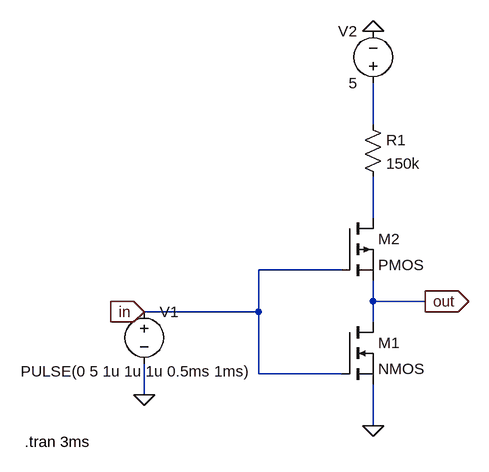
[diagram p0: schematic CMOS equivalente - negación.asc]
CMOS equivalente - negación.asc, the LTspice schematic file:
Version 4
SHEET 1 880 680
WIRE 80 16 80 -48
WIRE 80 160 80 96
WIRE 32 240 -96 240
WIRE 80 288 80 256
WIRE 160 288 80 288
WIRE -96 304 -96 240
WIRE -96 304 -272 304
WIRE 80 320 80 288
WIRE -96 400 -96 304
WIRE 32 400 -96 400
WIRE -272 432 -272 384
WIRE 80 480 80 416
FLAG -272 432 0
FLAG 80 480 0
FLAG 160 288 out
IOPIN 160 288 Out
FLAG -272 304 in
IOPIN -272 304 In
FLAG 80 -128 0
SYMBOL nmos 32 320 R0
SYMATTR InstName M1
SYMBOL voltage -272 288 R0
WINDOW 3 -190 108 Left 2
WINDOW 123 0 0 Left 0
WINDOW 39 0 0 Left 0
SYMATTR InstName V1
SYMATTR Value PULSE(0 5 1u 1u 1u 0.5ms 1ms)
SYMBOL res 64 0 R0
SYMATTR InstName R1
SYMATTR Value 150k
SYMBOL voltage 80 -32 R180
WINDOW 0 24 96 Left 2
WINDOW 3 24 16 Left 2
WINDOW 123 0 0 Left 0
WINDOW 39 0 0 Left 0
SYMATTR InstName V2
SYMATTR Value 5
SYMBOL pmos 32 160 R0
SYMATTR InstName M2
TEXT -456 504 Left 2 !.tran 3ms

The netlist it stands for:
* CMOS equivalente - negación.asc
M1 out in 0 0 NMOS
V1 in 0 PULSE(0 5 1u 1u 1u 0.5ms 1ms)
R1 N001 N002 150k
V2 N001 0 5
M2 N002 in out out PMOS
.model NMOS NMOS
.model PMOS PMOS
.lib standard.mos
.tran 3ms
.backanno
.end